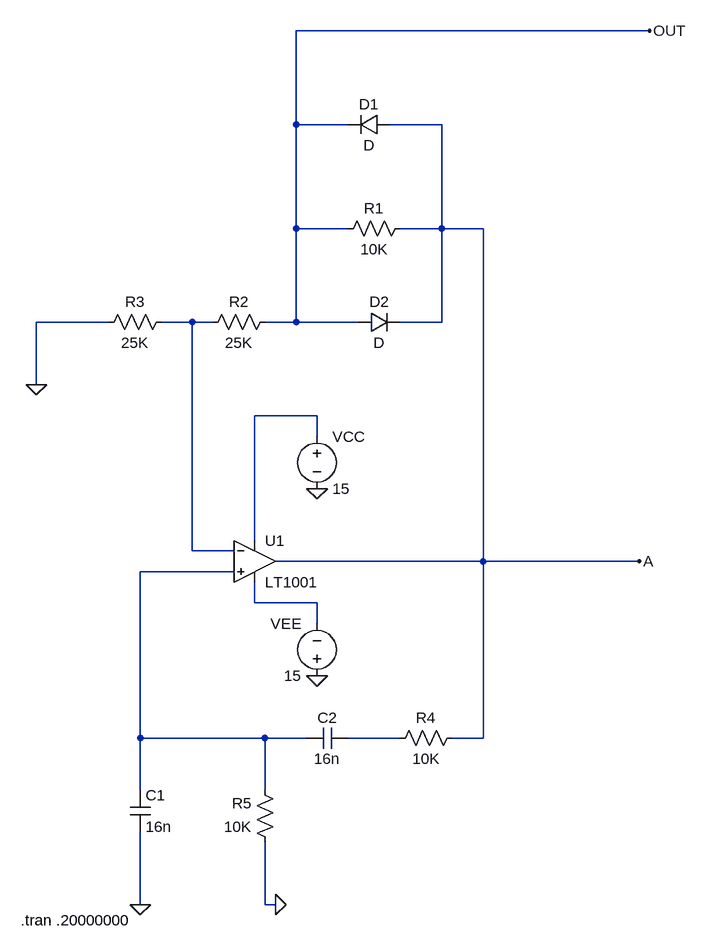
[diagram p0: schematic Wein-Bridge Oscillator.asc]
Wein-Bridge Oscillator.asc, the LTspice schematic file:
Version 4
SHEET 1 932 856
WIRE 864 -528 320 -528
WIRE 320 -384 320 -528
WIRE 400 -384 320 -384
WIRE 544 -384 464 -384
WIRE 320 -224 320 -384
WIRE 400 -224 320 -224
WIRE 544 -224 544 -384
WIRE 544 -224 480 -224
WIRE 608 -224 544 -224
WIRE 32 -80 -80 -80
WIRE 160 -80 112 -80
WIRE 192 -80 160 -80
WIRE 320 -80 320 -224
WIRE 320 -80 272 -80
WIRE 416 -80 320 -80
WIRE 544 -80 544 -224
WIRE 544 -80 480 -80
WIRE -80 16 -80 -80
WIRE 352 64 256 64
WIRE 352 96 352 64
WIRE 256 256 256 64
WIRE 160 272 160 -80
WIRE 224 272 160 272
WIRE 608 288 608 -224
WIRE 608 288 288 288
WIRE 848 288 608 288
WIRE 224 304 80 304
WIRE 256 352 256 320
WIRE 352 352 256 352
WIRE 352 384 352 352
WIRE 80 560 80 304
WIRE 272 560 80 560
WIRE 336 560 272 560
WIRE 480 560 400 560
WIRE 608 560 608 288
WIRE 608 560 560 560
WIRE 80 640 80 560
WIRE 272 640 272 560
WIRE 80 816 80 704
WIRE 272 816 272 720
WIRE 288 816 272 816
FLAG 352 176 0
FLAG 352 464 0
FLAG -80 16 0
FLAG 80 816 0
FLAG 288 816 0
FLAG 864 -528 OUT
FLAG 848 288 A
SYMBOL voltage 352 80 R0
WINDOW 123 0 0 Left 0
WINDOW 39 0 0 Left 0
SYMATTR InstName VCC
SYMATTR Value 15
SYMBOL OpAmps\\LT1001 256 224 R0
SYMATTR InstName U1
SYMBOL voltage 352 480 R180
WINDOW 0 24 96 Left 2
WINDOW 3 24 16 Left 2
SYMATTR InstName VEE
SYMATTR Value 15
SYMBOL diode 464 -400 R90
WINDOW 0 0 32 VBottom 2
WINDOW 3 32 32 VTop 2
SYMATTR InstName D1
SYMBOL diode 416 -64 R270
WINDOW 0 32 32 VTop 2
WINDOW 3 0 32 VBottom 2
SYMATTR InstName D2
SYMBOL res 496 -240 R90
WINDOW 0 0 56 VBottom 2
WINDOW 3 32 56 VTop 2
SYMATTR InstName R1
SYMATTR Value 10K
SYMBOL res 288 -96 R90
WINDOW 0 0 56 VBottom 2
WINDOW 3 32 56 VTop 2
SYMATTR InstName R2
SYMATTR Value 25K
SYMBOL res 128 -96 R90
WINDOW 0 0 56 VBottom 2
WINDOW 3 32 56 VTop 2
SYMATTR InstName R3
SYMATTR Value 25K
SYMBOL res 576 544 R90
WINDOW 0 0 56 VBottom 2
WINDOW 3 32 56 VTop 2
SYMATTR InstName R4
SYMATTR Value 10K
SYMBOL res 288 736 R180
WINDOW 0 36 76 Left 2
WINDOW 3 36 40 Left 2
SYMATTR InstName R5
SYMATTR Value 10K
SYMBOL cap 64 640 R0
SYMATTR InstName C1
SYMATTR Value 16n
SYMBOL cap 400 544 R90
WINDOW 0 0 32 VBottom 2
WINDOW 3 32 32 VTop 2
SYMATTR InstName C2
SYMATTR Value 16n
TEXT -104 840 Left 2 !.tran .20000000

The netlist it stands for:
* Wein-Bridge Oscillator.asc
VCC N002 0 15
XU1 N003 N001 N002 N004 A LT1001  ; pins In+ In- V+ V- OUT
VEE 0 N004 15
D1 A OUT D
D2 OUT A D
R1 A OUT 10K
R2 OUT N001 25K
R3 N001 0 25K
R4 A N005 10K
R5 0 N003 10K
C1 N003 0 16n
C2 N005 N003 16n
.model D D
.lib standard.dio
.tran .20000000
.lib LTC.lib
.backanno
.end